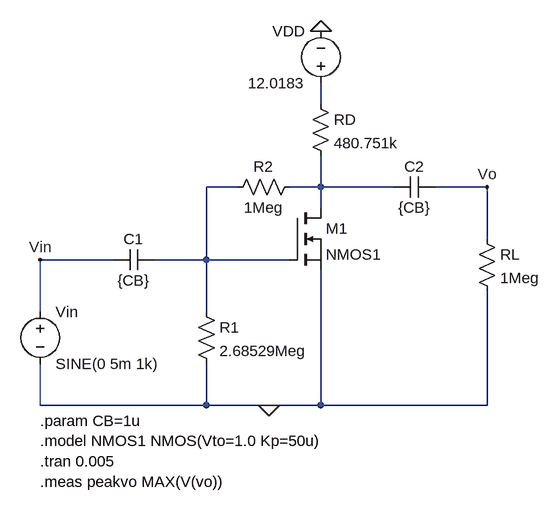
[diagram p0: schematic class_A_amp.asc]
class_A_amp.asc, the LTspice schematic file:
Version 4.1
SHEET 1 980 680
WIRE 592 -192 592 -224
WIRE 464 -64 416 -64
WIRE 592 -64 592 -112
WIRE 592 -64 544 -64
WIRE 704 -64 592 -64
WIRE 848 -64 768 -64
WIRE 592 -32 592 -64
WIRE 848 16 848 -64
WIRE 272 48 160 48
WIRE 416 48 416 -64
WIRE 416 48 336 48
WIRE 544 48 416 48
WIRE 160 128 160 48
WIRE 416 128 416 48
WIRE 160 272 160 208
WIRE 416 272 416 208
WIRE 416 272 160 272
WIRE 512 272 416 272
WIRE 592 272 592 64
WIRE 592 272 512 272
WIRE 848 272 848 96
WIRE 848 272 592 272
FLAG 512 272 0
FLAG 592 -304 0
FLAG 160 48 Vin
FLAG 848 -64 Vo
SYMBOL voltage 160 112 R0
WINDOW 123 0 0 Left 0
WINDOW 39 0 0 Left 0
SYMATTR InstName Vin
SYMATTR Value SINE(0 5m 1k)
SYMBOL cap 336 32 R90
WINDOW 0 0 32 VBottom 2
WINDOW 3 32 32 VTop 2
SYMATTR InstName C1
SYMATTR Value {CB}
SYMBOL res 400 112 R0
SYMATTR InstName R1
SYMATTR Value 2.68529Meg
SYMBOL res 560 -80 R90
WINDOW 0 0 56 VBottom 2
WINDOW 3 32 56 VTop 2
SYMATTR InstName R2
SYMATTR Value 1Meg
SYMBOL nmos 544 -32 R0
SYMATTR InstName M1
SYMATTR Value NMOS1
SYMBOL res 576 -208 R0
SYMATTR InstName RD
SYMATTR Value 480.751k
SYMBOL cap 768 -80 R90
WINDOW 0 0 32 VBottom 2
WINDOW 3 32 32 VTop 2
SYMATTR InstName C2
SYMATTR Value {CB}
SYMBOL res 832 0 R0
SYMATTR InstName RL
SYMATTR Value 1Meg
SYMBOL voltage 592 -208 R180
WINDOW 0 24 96 Left 2
WINDOW 3 24 16 Left 2
SYMATTR InstName VDD
SYMATTR Value 12.0183
TEXT 160 296 Left 2 !.param CB=1u\n.model NMOS1 NMOS(Vto=1.0 Kp=50u)\n.tran 0.005\n.meas peakvo MAX(V(vo))

The netlist it stands for:
* class_A_amp.asc
Vin Vin 0 SINE(0 5m 1k)
C1 N002 Vin {CB}
R1 N002 0 2.68529Meg
R2 N003 N002 1Meg
M1 N003 N002 0 0 NMOS1
RD N001 N003 480.751k
C2 Vo N003 {CB}
RL Vo 0 1Meg
VDD N001 0 12.0183
.model NMOS NMOS
.model PMOS PMOS
.lib standard.mos
.param CB=1u
.model NMOS1 NMOS(Vto=1.0 Kp=50u)
.tran 0.005
.meas peakvo MAX(V(vo))
.backanno
.end